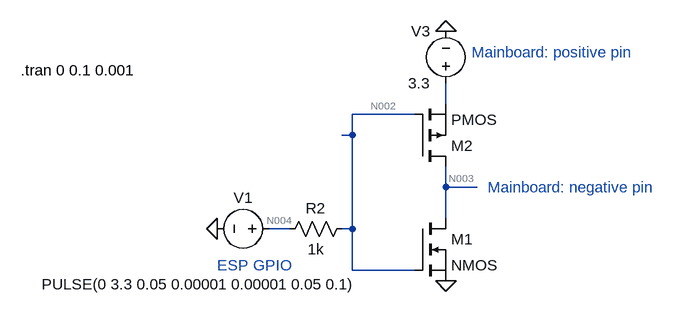
[diagram p0: schematic version1-0.asc]
version1-0.asc, the LTspice schematic file:
Version 4
SHEET 1 880 680
WIRE 336 80 336 48
WIRE 288 96 192 96
WIRE 192 128 192 96
WIRE 192 128 176 128
WIRE 336 208 336 176
WIRE 384 208 336 208
WIRE 336 256 336 208
WIRE 96 272 64 272
WIRE 192 272 192 128
WIRE 192 272 176 272
WIRE 192 336 192 272
WIRE 288 336 192 336
FLAG 336 -32 0
FLAG 336 352 0
FLAG -16 272 0
SYMBOL voltage 80 272 R90
WINDOW 0 -32 56 VBottom 2
WINDOW 3 70 123 VTop 2
WINDOW 123 0 0 Left 2
WINDOW 39 0 0 Left 2
SYMATTR InstName V1
SYMATTR Value PULSE(0 3.3 0.05 0.00001 0.00001 0.05 0.1)
SYMBOL nmos 288 256 R0
SYMATTR InstName M1
SYMBOL pmos 288 176 M180
SYMATTR InstName M2
SYMBOL voltage 336 64 R180
WINDOW 0 24 96 Left 2
WINDOW 3 24 16 Left 2
WINDOW 123 0 0 Left 2
WINDOW 39 0 0 Left 2
SYMATTR InstName V3
SYMATTR Value 3.3
SYMBOL res 192 256 R90
WINDOW 0 0 56 VBottom 2
WINDOW 3 32 56 VTop 2
SYMATTR InstName R2
SYMATTR Value 1k
TEXT -318 28 Left 2 !.tran 0 0.1 0.001
TEXT 376 0 Left 2 ;Mainboard: positive pin
TEXT 400 208 Left 2 ;Mainboard: negative pin
TEXT -16 328 Left 2 ;ESP GPIO

The netlist it stands for:
* version1-0.asc
V1 N004 0 PULSE(0 3.3 0.05 0.00001 0.00001 0.05 0.1)
M1 N003 N002 0 0 NMOS
M2 N003 N002 N001 N001 PMOS
V3 N001 0 3.3
R2 N002 N004 1k
.model NMOS NMOS
.model PMOS PMOS
.lib standard.mos
.tran 0 0.1 0.001
* Mainboard: positive pin
* Mainboard: negative pin
* ESP GPIO
.backanno
.end

* Results of the author's LTspice run, read from the files saved beside the schematic
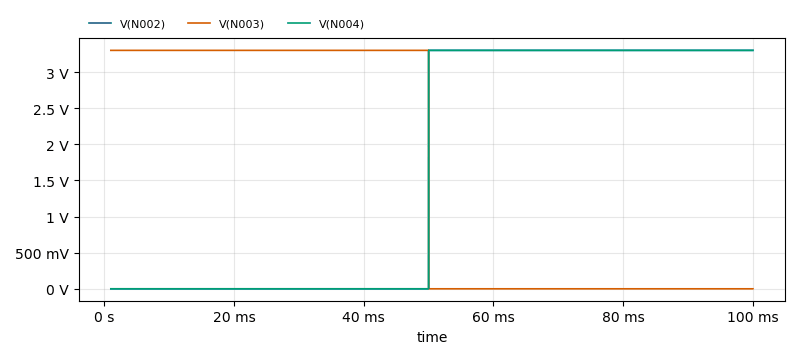
[diagram p1: Transient Analysis of version1-0.asc, plotted from the saved traces]
* Transient Analysis, 1 run:
*   V(N002): min 0 V, max 3.3 V, average 1.666 V, rms 2.345 V, last 3.3 V
*   V(N003): min 0 V, max 3.3 V, average 1.634 V, rms 2.322 V, last 0 V
*   V(N004): min 0 V, max 3.3 V, average 1.666 V, rms 2.345 V, last 3.3 V